# Altium schematic sheet MCU.SchDoc
size A
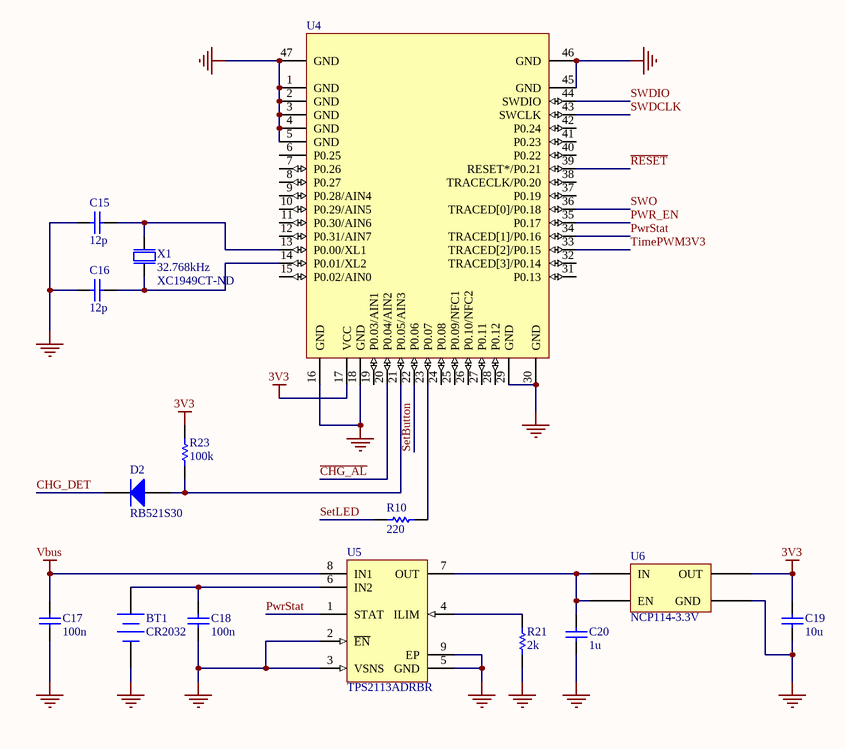
[diagram p0: MCU.SchDoc]

## Parts
BT1  CR2032  [BK-912]
C15  12p  [CAPC0402(1005)60_N]
C16  12p  [CAPC0402(1005)60_N]
C17  100n  [CAPC0402(1005)33_N]
C18  100n  [CAPC0402(1005)33_N]
C19  10u  [CAPC0603(1608)100_N]
C20  1u  [CAPC0603(1608)100_N]
D2  RB521S30  [SOD-523]
R10  220  [RESC0402(1005)_N]
R21  2k  [RESC0402(1005)_N]
R23  100k  [RESC0402(1005)_N]
U4  BMD-300  [BMD-300]  (value not drawn)
U5  TPS2113ADRBR  [VSON-8]
U6  NCP114-3.3V  [TSOP-5]
X1  32.768kHz  Supplier Part Number 1: XC1949CT-ND  [3215 XTAL]

## Nets
3V3: C19.2 R23.2 U4.17(VCC) U6.5(OUT)
GND: BT1.2(-) C15.1 C16.1 C17.1 C18.1 C19.1 C20.1 R21.1 U4.1(GND) U4.2(GND) U4.3(GND) U4.4(GND) U4.5(GND) U4.16(GND) U4.18(GND) U4.29(GND) U4.30(GND) U4.45(GND) U4.46(GND) U4.47(GND) U5.2(~{EN}) U5.3(VSNS) U5.5(GND) U5.9(EP) U6.2(GND)
Vbus: C17.2 U5.8(IN1)
~{CHG_AL}: U4.20(P0.04/AIN2)
CHG_DET: D2.1(K)
PWR_EN: U4.35(P0.17)
PwrStat: U4.34(TRACED[1]/P0.16) U5.1(STAT)
~{RESET}: U4.39(RESET*/P0.21)
SetButton: U4.22(P0.06)
SetLED: R10.1
SWDCLK: U4.43(SWCLK)
SWDIO: U4.44(SWDIO)
SWO: U4.36(TRACED[0]/P0.18)
TimePWM3V3: U4.33(TRACED[2]/P0.15)
NetBT1_1: BT1.1(+) C18.2 U5.6(IN2)
NetC15_2: C15.2 U4.13(P0.00/XL1) X1.2
NetC16_2: C16.2 U4.14(P0.01/XL2) X1.1
NetC20_2: C20.2 U5.7(OUT) U6.1(IN) U6.3(EN)
NetD2_2: D2.2(A) R23.1 U4.21(P0.05/AIN3)
NetR10_2: R10.2 U4.23(P0.07)
NetR21_2: R21.2 U5.4(ILIM)

Not connected (* = marked no-connect by the designer): U4 6(P0.25) 7(P0.26) 8(P0.27) 9(P0.28/AIN4) 10(P0.29/AIN5) 11(P0.30/AIN6) 12(P0.31/AIN7) 15(P0.02/AIN0) 19(P0.03/AIN1) 24(P0.08) 25(P0.09/NFC1) 26(P0.10/NFC2) 27(P0.11) 28(P0.12) 31(P0.13) 32(TRACED[3]/P0.14) 37(P0.19) 38(TRACECLK/P0.20) 40(P0.22) 41(P0.23) 42(P0.24)

## Library data of the parts
BT1 = BK-912: BATTERY RETAINER COIN 20MM SMD; Manufacturer: Memory Protection Devices; Manufacturer Part Number: BK-912-TR; Number of Cells: 1; Supplier 1: Digi-Key; Stock 1: 39032; Pricing 1: 1=0.73, 10=0.661, 100=0.5138 (USD); Mount: PCB,Surface Mount; Case/Package: SMD/SMT; Package Quantity: 700; Termination: SMD/SMT; ComponentLink1URL: https://media.digikey.com/pdf/Data%20Sheets/Memory%20Protection%20PDFs/Coin_Cell_Guide.pdf; ComponentLink1Description: https://media.digikey.com/pdf/Data%20Sheets/Memory%20Protection%20PDFs/Coin_Cell_Guide.pdf; Supplier Part Number 1: BK-912-CT-ND
C15 C16 = CC0402FRNPO9BN120: CAP CER 12PF 50V C0G/NPO 0402; Manufacturer: Yageo; Tolerance: ±1%; Temperature Coefficient: C0G, NP0; Notification: Current market demand for these product types have resulted in fluctuating and extending lead times. Lead times may differ.; Supplier 1: Digi-Key; Manufacturer Part Number: CC0402FRNPO9BN120; RoHS: RoHS Compliant; Category: Capacitors; Stock 1: 100000; Pricing 1: 1=0.14, 10=0.104, 100=0.0464, 500=0.03312, 1000=0.02603, 2500=0.02366, 5000=0.02177 (USD); Packaging: Cut Tape (CT); Part Status: Active; Voltage - Rated: 50V; Operating Temperature: -55°C ~ 125°C; Features: -; Ratings: -; Applications: General Purpose; Failure Rate: -; Mounting Type: Surface Mount, MLCC; Package / Case: 0402 (1005 Metric); Size / Dimension: 0.039" L x 0.020" W (1.00mm x 0.50mm); Height - Seated (Max): -; Thickness (Max): 0.022" (0.55mm); Lead Spacing: -; Lead Style: -; ComponentLink1URL: http://www.yageo.com/documents/recent/UPY-GP_NP0_16V-to-50V_16.pdf; ComponentLink1Description: http://www.yageo.com/documents/recent/UPY-GP_NP0_16V-to-50V_16.pdf; Supplier Part Number 1: 311-1641-1-ND
C17 C18 = CC0402KRX7R8BB104: CAP CER 0.1UF 25V X7R 0402; Manufacturer: Yageo; Tolerance: ±10%; Notification: Current market demand for these product types have resulted in fluctuating and extending lead times. Lead times may differ.; Supplier 1: Digi-Key; Manufacturer Part Number: CC0402KRX7R8BB104; RoHS: RoHS Compliant; Category: Capacitors; Stock 1: 0; Pricing 1: 1=0.1, 10=0.048, 100=0.0215, 500=0.01534, 1000=0.01205, 2500=0.01095, 5000=0.01007 (USD); Packaging: Cut Tape (CT); Part Status: Active; Voltage - Rated: 25V; Temperature Coefficient: X7R; Operating Temperature: -55°C ~ 125°C; Features: -; Ratings: -; Applications: General Purpose; Failure Rate: -; Mounting Type: Surface Mount, MLCC; Package / Case: 0402 (1005 Metric); Size / Dimension: 0.039" L x 0.020" W (1.00mm x 0.50mm); Height - Seated (Max): -; Thickness (Max): 0.022" (0.55mm); Lead Spacing: -; Lead Style: -; ComponentLink1URL: http://www.yageo.com/documents/recent/UPY-GPHC_X7R_6.3V-to-50V_18.pdf; ComponentLink1Description: http://www.yageo.com/documents/recent/UPY-GPHC_X7R_6.3V-to-50V_18.pdf; Supplier Part Number 1: 311-2077-1-ND; Supplier 2: Mouser; Supplier Part Number 2: 603-CC402KRX7R8BB104
C19 = GRM188R61C106KAALD: Multilayer Ceramic Capacitors MLCC - SMD/SMT 0603 10uF 16volts X5R 10%; Manufacturer: Murata; Voltage Rating: 16V; Supplier 1: Digi-Key; Manufacturer Part Number: GRM188R61C106KAALD; Stock 1: 0; Pricing 1: 1=0.49, 10=0.339, 100=0.2036, 500=0.15266, 1000=0.12892 (USD); Mount: Surface Mount; Case/Package: 0603; Weight: 0.000222oz; Case Code (Metric): 1608; Case Code (Imperial): 0603; Min Operating Temperature: -55°C; Max Operating Temperature: 85°C; Capacitance: 10uF; Packaging: Tape and Reel; Dielectric: X5R; Tolerance: 10%; Termination: SMD/SMT; Composition: Ceramic; Voltage Rating (DC): 16V; Package Quantity: 4000; Length: 0.063inch; Height: 0.8mm; Width: 0.8mm; Thickness: 0.037inch; REACH SVHC: No SVHC; Lead Free: Lead Free; Supplier Part Number 1: 490-10728-1-ND
C20 = CL10B105MO8NNWC: CAP CER 1UF 16V X7R 0603; Manufacturer: Samsung Electro-Mechanics; Tolerance: ±20%; Notification: Current market demand for these product types have resulted in fluctuating and extending lead times. Lead times may differ.; Supplier 1: Digi-Key; Manufacturer Part Number: CL10B105MO8NNWC; RoHS: RoHS Compliant; Category: Capacitors; Stock 1: 40000; Pricing 1: 1=0.1, 10=0.043, 100=0.0194, 500=0.01406, 1000=0.01121 (USD); Packaging: Cut Tape (CT); Part Status: Active; Voltage - Rated: 16V; Temperature Coefficient: X7R; Operating Temperature: -55°C ~ 125°C; Features: -; Ratings: -; Applications: General Purpose; Mounting Type: Surface Mount, MLCC; Package / Case: 0603 (1608 Metric); Size / Dimension: 0.063" L x 0.031" W (1.60mm x 0.80mm); Height - Seated (Max): -; Thickness (Max): 0.035" (0.90mm); Lead Spacing: -; Lead Style: -; ComponentLink1URL: http://www.samsungsem.com/kr/support/product-search/mlcc/CL10B105MO8NNWC.jsp; ComponentLink1Description: http://www.samsungsem.com/kr/support/product-search/mlcc/CL10B105MO8NNWC.jsp; Supplier Part Number 1: 1276-6524-1-ND
D2 = RB521S30: DIODE SCHOTTKY 30V 200MA SOD523F; Manufacturer: ON Semiconductor / Fairchild; Forward Voltage: 500mV; Element Configuration: Single; Max Reverse Leakage Current: 30uA; Power Dissipation: 200mW; Supplier 1: Digi-Key; Manufacturer Part Number: RB521S30; Stock 1: 44826; Pricing 1: 1=0.23, 10=0.191, 100=0.1011, 500=0.0665, 1000=0.04522 (USD); Mount: Surface Mount; Number of Pins: 2; Weight: 0.01g; Min Operating Temperature: -55°C; Max Operating Temperature: 125°C; Packaging: Tape and Reel; Forward Current: 200mA; Max Repetitive Reverse Voltage (Vrrm): 30V; Package Quantity: 1; Average Rectified Current: 200mA; Peak Reverse Current: 30uA; Max Reverse Voltage (DC): 30V; Length: 1.3mm; Height: 0.7mm; Width: 0.9mm; Radiation Hardening: No; REACH SVHC: No SVHC; Lead Free: Lead Free; ComponentLink1URL: http://www.fairchildsemi.com/ds/RB/RB521S30.pdf; ComponentLink1Description: http://www.fairchildsemi.com/ds/RB/RB521S30.pdf; ComponentLink2URL: https://www.fairchildsemi.com/datasheets/RB/RB521S30.pdf; ComponentLink2Description: https://www.fairchildsemi.com/datasheets/RB/RB521S30.pdf; ComponentLink3URL: https://www.verical.com/server-webapp/html/getDatasheet?partID=71229; ComponentLink3Description: https://www.verical.com/server-webapp/html/getDatasheet?partID=71229; Supplier Part Number 1: RB521S30CT-ND
R10 = RC0402FR-07220RL: RES SMD 220 OHM 1% 1/16W 0402; Manufacturer: Yageo; Resistance: 220R; Power Rating: 62.5mW; Voltage Rating: 50V; Temperature Coefficient: 100ppm/°C; Max Power Dissipation: 63mW; Supplier 1: Digi-Key; Manufacturer Part Number: RC0402FR-07220RL; Stock 1: 5150470; Pricing 1: 1=0.1, 10=0.018, 100=0.0073, 1000=0.00329, 2500=0.00286, 5000=0.00236 (USD); Case/Package: 0402; Number of Pins: 2; Case Code (Imperial): 0402; Case Code (Metric): 1005; Min Operating Temperature: -55°C; Max Operating Temperature: 155°C; Tolerance: 1%; Packaging: Tape and Reel; Voltage Rating (DC): 50V; Termination: SMD/SMT; Composition: Thick Film; Military Standard: Not; Package Quantity: 1; Number of Terminations: 2; Features: Moisture Resistant; Length: 1mm; Height: 0.016inch; Width: 0.02inch; Depth: 0.5mm; REACH SVHC: No SVHC; Lead Free: Lead Free; ComponentLink1URL: http://www.yageo.com/documents/recent/PYu-RC_Group_51_RoHS_L_9.pdf; ComponentLink1Description: http://www.yageo.com/documents/recent/PYu-RC_Group_51_RoHS_L_9.pdf; ComponentLink2URL: http://documents.rs-components.com/techlib://itc_doclist_GB.htm?stockno=6186324; ComponentLink2Description: http://documents.rs-components.com/techlib://itc_doclist_GB.htm?stockno=6186324; ComponentLink3URL: http://www.yageo.com/documents/recent/PYu-RC0402_51_RoHS_L_6_r.pdf; ComponentLink3Description: http://www.yageo.com/documents/recent/PYu-RC0402_51_RoHS_L_6_r.pdf; Supplier Part Number 1: 311-220LRCT-ND
R21 = RC0402FR-072KL: RES SMD 2K OHM 1% 1/16W 0402; Manufacturer: Yageo; Power (Watts): 0.063W, 1/16W; Temperature Coefficient: ±100ppm/°C; Supplier 1: Digi-Key; Manufacturer Part Number: RC0402FR-072KL; RoHS: RoHS Compliant; Category: Resistors; Stock 1: 8929494; Pricing 1: 1=0.1, 10=0.018, 100=0.0076, 1000=0.00356, 2500=0.00313, 5000=0.00263 (USD); Packaging: Cut Tape (CT); Part Status: Active; Tolerance: ±1%; Composition: Thick Film; Features: Moisture Resistant; Operating Temperature: -55°C ~ 155°C; Package / Case: 0402 (1005 Metric); Supplier Device Package: 0402; Size / Dimension: 0.039" L x 0.020" W (1.00mm x 0.50mm); Height - Seated (Max): 0.016" (0.40mm); Failure Rate: -; ComponentLink1URL: http://www.yageo.com/documents/recent/PYu-RC_Group_51_RoHS_L_9.pdf; ComponentLink1Description: http://www.yageo.com/documents/recent/PYu-RC_Group_51_RoHS_L_9.pdf; Supplier Part Number 1: 311-2KLRCT-ND
R23 = RC0402FR-07100KL: RES SMD 100K OHM 1% 1/16W 0402; Manufacturer: Yageo; Power (Watts): 0.063W, 1/16W; Temperature Coefficient: ±100ppm/°C; Supplier 1: Digi-Key; Manufacturer Part Number: RC0402FR-07100KL; RoHS: RoHS Compliant; Category: Resistors; Stock 1: 20396473; Pricing 1: 1=0.1, 10=0.018, 100=0.0076, 1000=0.00356, 2500=0.00313, 5000=0.00263 (USD); Packaging: Cut Tape (CT); Part Status: Active; Tolerance: ±1%; Composition: Thick Film; Features: Moisture Resistant; Operating Temperature: -55°C ~ 155°C; Package / Case: 0402 (1005 Metric); Supplier Device Package: 0402; Size / Dimension: 0.039" L x 0.020" W (1.00mm x 0.50mm); Height - Seated (Max): 0.016" (0.40mm); Failure Rate: -; ComponentLink1URL: http://www.yageo.com/documents/recent/PYu-RC_Group_51_RoHS_L_9.pdf; ComponentLink1Description: http://www.yageo.com/documents/recent/PYu-RC_Group_51_RoHS_L_9.pdf; Supplier Part Number 1: 311-100KLRCT-ND
U4 = BMD-300-A: Bluetooth 4.2 LE Module, nRF52832, 512kB Flash, 64kB RAM; Manufacturer: Rigado; Manufacturer P/N: BMD-300-A-R; Internal Antenna: Yes; Protocol: BLE 4.2; RF Freq: 2.4GHz; Added By: Cam N; Data Rate: 2Mbps; Sensitivity: -96dBm; Interface: I2C,SPI,UART; Current - Receiving: 10.4mA; Current - Transmitting: 17mA; Part Number: BMD-300-A; Size: 14mm x 9.8mm; Height: 1.9mm; Added Date: 10/14/2015; Manufacturer Part Number: BMD-300-A-R; Mount: Surface Mount; Case/Package: Module; Min Operating Temperature: -40°C; Max Operating Temperature: 85°C; Packaging: Tape and Reel; Frequency: 2.4GHz; Memory Size: 64KB; Supplier 1: Digi-Key; Supplier Part Number 1: 1604-1006-1-ND
U5 = TPS2113ADRB: Dual In / Single Out Autoswitching Power Mux, 2.8 to 5.5 V, -40 to 85 degC, 9-pin SON (DRB), Green (RoHS & no Sb/Br); Manufacturer: Texas Instruments; IN1, IN2 Input Voltage(Min)(V): 2.8; SubFamily: Power Multiplexer (MUX); IN1 rDS(on)(Typ)(mOhm): 84; IN2 rDS(on)(Typ)(Ohms): 0.084; Number of Inputs: 2; IN1, IN2 Input Voltage(Max)(V): 5.5; IN2 Output Current(Max)(A): 1.25; Operating Supply Voltage: 5.5V; Number of Outputs: 1; Output Current: 1.25A; Min Input Voltage: 2.8V; Turn-On Delay Time: 1ms; PackageVersion: revK, Jun-2012; PackageDescription: 8-Pin Plastic Small Outline No-Lead, 3 x 3 x 1 mm Body, 0.65 mm Pitch, Exposed Pad; ComponentLink1Description: Datasheet; ComponentLink1URL: http://www.ti.com/general/docs/lit/getliterature.tsp?genericPartNumber=TPS2113A&fileType=pdf; DatasheetVersion: SBVS045C; Eco-Plan: Green (RoHS & no Sb/Br); PartNumber: TPS2113ADRBR; Mounting Technology: Surface Mount; PackageReference: DRB0008B; IN1 Output Current(Max)(A): 1.25; Supplier 1: Digi-Key; Manufacturer Part Number: TPS2113ADRBR; Stock 1: 8863; Pricing 1: 1=2.01, 10=1.801, 100=1.448, 500=1.18966, 1000=0.98571 (USD); Case/Package: TSSOP; Number of Pins: 8; Min Operating Temperature: -40°C; Max Operating Temperature: 85°C; Package Quantity: 3000; Packaging: Tape and Reel; Max Output Current: 1.25A; Max Input Voltage: 5.5V; Current - Output 2: 1.25A; Radiation Hardening: No; Lead Free: Lead Free; ComponentLink2URL: http://www.ti.com/general/docs/lit/getliterature.tsp?genericPartNumber=TPS2113A&&fileType=pdf; ComponentLink2Description: http://www.ti.com/general/docs/lit/getliterature.tsp?genericPartNumber=TPS2113A&&fileType=pdf; ComponentLink3URL: https://www.verical.com/server-webapp/html/getDatasheet?partID=627486; ComponentLink3Description: https://www.verical.com/server-webapp/html/getDatasheet?partID=627486; ComponentLink4URL: http://www.ti.com/lit/ds/symlink/tps2113a.pdf; ComponentLink4Description: http://www.ti.com/lit/ds/symlink/tps2113a.pdf; Supplier Part Number 1: 296-46373-1-ND
U6 = NCP114ASN330T1G: IC REG LINEAR 3.3V 300MA 5TSOP; Manufacturer: ON Semiconductor; Supplier 1: Digi-Key; Supplier Part Number 1: NCP114ASN330T1GOSCT-ND; Manufacturer Part Number: NCP114ASN330T1G; Stock 1: 16190; Pricing 1: 1=0.35, 10=0.264, 100=0.1493, 500=0.09888, 1000=0.07581 (USD); Output Current: 300mA; Lead Free: Lead Free; Supplier 2: Mouser; Supplier Part Number 2: 863-NCP114ASN330T1G
X1 = ECS-.327-9-34B-C-TR: CRYSTAL 32.7680KHZ 9PF SMD; Manufacturer: ECS International; Frequency Tolerance: 10ppm; ESR (Equivalent Series Resistance): 70kR; Supplier 1: Digi-Key; Manufacturer Part Number: ECS-.327-9-34B-C-TR; Mount: Surface Mount; Case/Package: SMD/SMT; Number of Pins: 2; Min Operating Temperature: -40°C; Max Operating Temperature: 85°C; Load Capacitance: 9pF; Package Quantity: 3000; Packaging: Tape and Reel; Frequency: 32.768kHz; Termination: SMD/SMT; Frequency Stability: 10ppm; Length: 0.126inch; Height: 0.035inch; Width: 0.061inch; Lead Pitch: 2.4mm; ComponentLink1URL: http://www.ecsxtal.com/store/pdf/ecx-31b.pdf; ComponentLink1Description: http://www.ecsxtal.com/store/pdf/ecx-31b.pdf; Stock 1: 17736; Pricing 1: 1=0.81, 10=0.712, 50=0.666, 100=0.5886, 500=0.55758, 1000=0.46466 (USD)